# Altium schematic sheet ringled.SchDoc
size A4
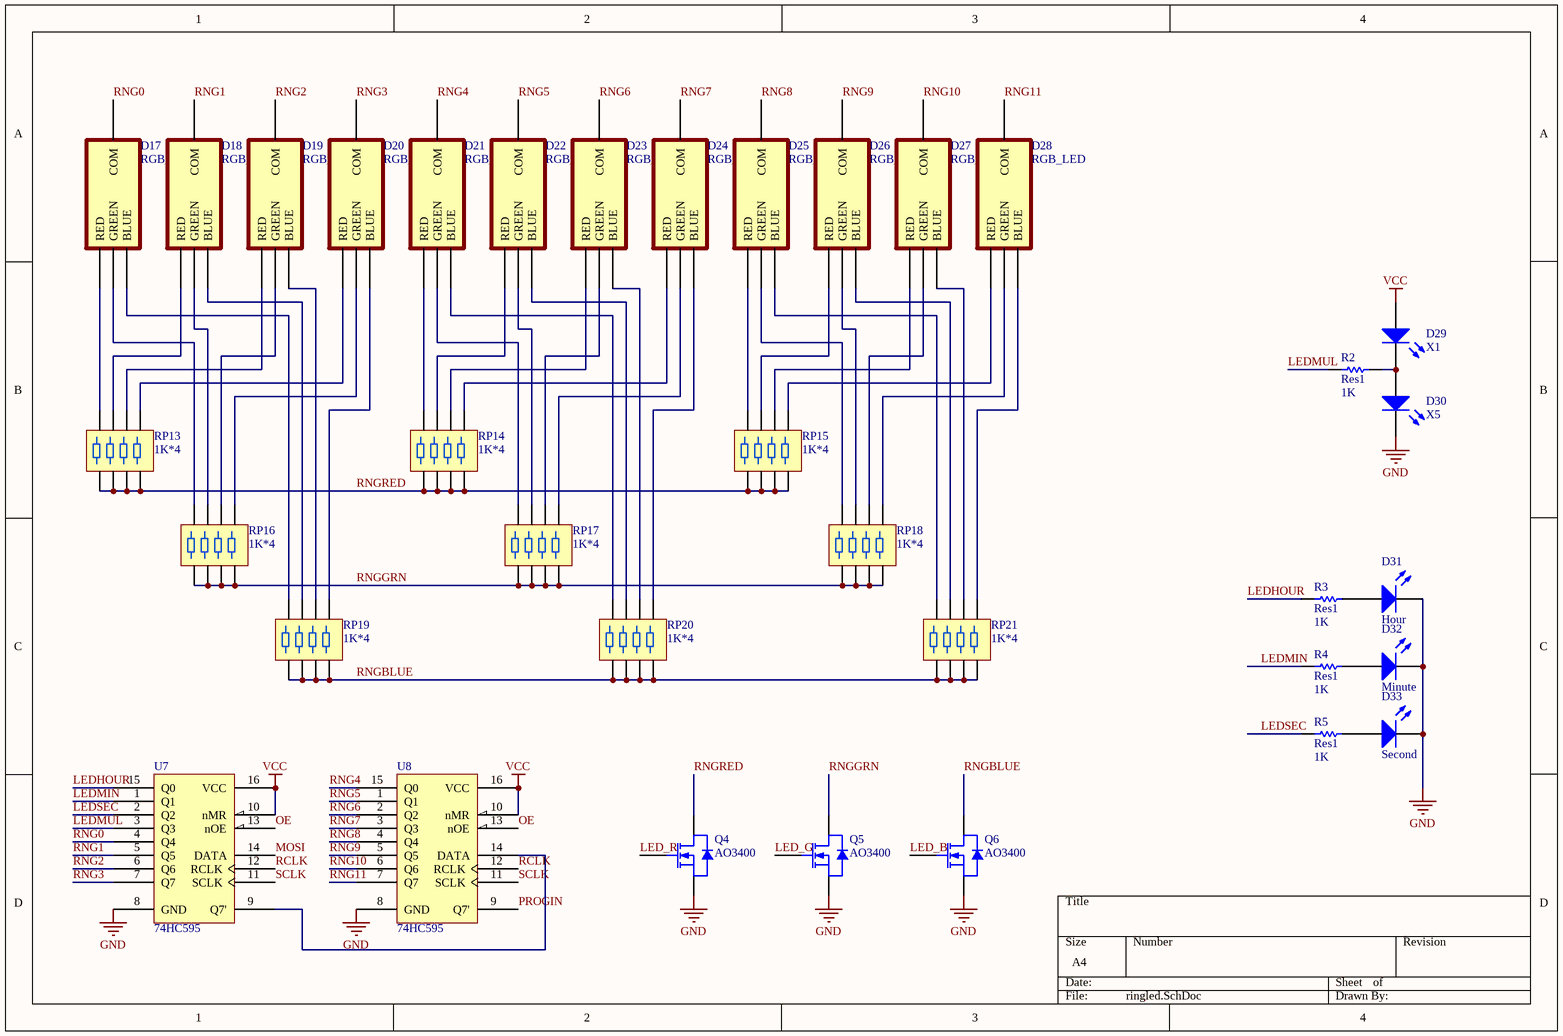
[diagram p0: ringled.SchDoc]

## Parts
D17  RGB_LED  [0805_RGB]
D18  RGB_LED  [0805_RGB]
D19  RGB_LED  [0805_RGB]
D20  RGB_LED  [0805_RGB]
D21  RGB_LED  [0805_RGB]
D22  RGB_LED  [0805_RGB]
D23  RGB_LED  [0805_RGB]
D24  RGB_LED  [0805_RGB]
D25  RGB_LED  [0805_RGB]
D26  RGB_LED  [0805_RGB]
D27  RGB_LED  [0805_RGB]
D28  RGB_LED  [0805_RGB]
D29  X1  [0805_LED]
D30  X5  [0805_LED]
D31  Hour  [0805_LED]
D32  Minute  [0805_LED]
D33  Second  [0805_LED]
Q4  AO3400  [SOT-23]
Q5  AO3400  [SOT-23]
Q6  AO3400  [SOT-23]
R2  Res1  value 1K  [0805]
R3  Res1  value 1K  [0805]
R4  Res1  value 1K  [0805]
R5  Res1  value 1K  [0805]
RP13  1K*4  [0603X4]
RP14  1K*4  [0603X4]
RP15  1K*4  [0603X4]
RP16  1K*4  [0603X4]
RP17  1K*4  [0603X4]
RP18  1K*4  [0603X4]
RP19  1K*4  [0603X4]
RP20  1K*4  [0603X4]
RP21  1K*4  [0603X4]
U7  74HC595  [TSSOP16]
U8  74HC595  [TSSOP16]

## Nets
GND: D30.2(K) D31.2(K) D32.2(K) D33.2(K) Q4.2(S) Q5.2(S) Q6.2(S) U7.8(GND) U8.8(GND)
VCC: D29.1(A) U7.10(nMR) U7.16(VCC) U8.10(nMR) U8.16(VCC)
LED_B: Q6.1(G)
LED_G: Q5.1(G)
LED_R: Q4.1(G)
LEDHOUR: R3.1 U7.15(Q0)
LEDMIN: R4.1 U7.1(Q1)
LEDMUL: R2.1 U7.3(Q3)
LEDSEC: R5.1 U7.2(Q2)
MOSI: U7.14(DATA)
OE: U7.13(nOE) U8.13(nOE)
PROGIN: U8.9(Q7')
RCLK: U7.12(RCLK) U8.12(RCLK)
RNG0: D17.COM U7.4(Q4)
RNG1: D18.COM U7.5(Q5)
RNG2: D19.COM U7.6(Q6)
RNG3: D20.COM U7.7(Q7)
RNG4: D21.COM U8.15(Q0)
RNG5: D22.COM U8.1(Q1)
RNG6: D23.COM U8.2(Q2)
RNG7: D24.COM U8.3(Q3)
RNG8: D25.COM U8.4(Q4)
RNG9: D26.COM U8.5(Q5)
RNG10: D27.COM U8.6(Q6)
RNG11: D28.COM U8.7(Q7)
RNGBLUE: Q6.3(D) RP19.1 RP19.2 RP19.3 RP19.4 RP20.1 RP20.2 RP20.3 RP20.4 RP21.1 RP21.2 RP21.3 RP21.4
RNGGRN: Q5.3(D) RP16.1 RP16.2 RP16.3 RP16.4 RP17.1 RP17.2 RP17.3 RP17.4 RP18.1 RP18.2 RP18.3 RP18.4
RNGRED: Q4.3(D) RP13.1 RP13.2 RP13.3 RP13.4 RP14.1 RP14.2 RP14.3 RP14.4 RP15.1 RP15.2 RP15.3 RP15.4
SCLK: U7.11(SCLK) U8.11(SCLK)
NetD17_B: D17.B(BLUE) RP19.8
NetD17_G: D17.G(GREEN) RP16.8
NetD17_R: D17.R(RED) RP13.8
NetD18_B: D18.B(BLUE) RP19.7
NetD18_G: D18.G(GREEN) RP16.7
NetD18_R: D18.R(RED) RP13.7
NetD19_B: D19.B(BLUE) RP19.6
NetD19_G: D19.G(GREEN) RP16.6
NetD19_R: D19.R(RED) RP13.6
NetD20_B: D20.B(BLUE) RP19.5
NetD20_G: D20.G(GREEN) RP16.5
NetD20_R: D20.R(RED) RP13.5
NetD21_B: D21.B(BLUE) RP20.8
NetD21_G: D21.G(GREEN) RP17.8
NetD21_R: D21.R(RED) RP14.8
NetD22_B: D22.B(BLUE) RP20.7
NetD22_G: D22.G(GREEN) RP17.7
NetD22_R: D22.R(RED) RP14.7
NetD23_B: D23.B(BLUE) RP20.6
NetD23_G: D23.G(GREEN) RP17.6
NetD23_R: D23.R(RED) RP14.6
NetD24_B: D24.B(BLUE) RP20.5
NetD24_G: D24.G(GREEN) RP17.5
NetD24_R: D24.R(RED) RP14.5
NetD25_B: D25.B(BLUE) RP21.8
NetD25_G: D25.G(GREEN) RP18.8
NetD25_R: D25.R(RED) RP15.8
NetD26_B: D26.B(BLUE) RP21.7
NetD26_G: D26.G(GREEN) RP18.7
NetD26_R: D26.R(RED) RP15.7
NetD27_B: D27.B(BLUE) RP21.6
NetD27_G: D27.G(GREEN) RP18.6
NetD27_R: D27.R(RED) RP15.6
NetD28_B: D28.B(BLUE) RP21.5
NetD28_G: D28.G(GREEN) RP18.5
NetD28_R: D28.R(RED) RP15.5
NetD29_2: D29.2(K) D30.1(A) R2.2
NetD31_1: D31.1(A) R3.2
NetD32_1: D32.1(A) R4.2
NetD33_1: D33.1(A) R5.2
NetU7_9: U7.9(Q7') U8.14(DATA)

## Library data of the parts
D17-D28 = RGBLED
D29-D33 = LED0: Typical INFRARED GaAs LED; Published: 8-Jun-2000; LatestRevisionDate: 08-Jul-2005; LatestRevisionNote: Mech Layer 1 removed.; PackageReference: LED-0; Publisher: Altium Limited; PackageDescription: LED; 2 Leads
Q4-Q6 = AO3400: N-Channel MOSFET; Published: 8-Jun-2000; Revision: July-2002: Re-released for DXP Platform.; Publisher: Altium Limited
R2-R5 = Res1: Resistor; Published: 8-Jun-2000; LatestRevisionDate: 17-Jul-2002; LatestRevisionNote: Re-released for DXP Platform.; PackageReference: AXIAL-0.3; Publisher: Altium Limited; PackageDescription: Axial Device, Thru-Hole; 2 Leads; 0.3 in Pin Spacing
RP13-RP21 = RPack_4
U7 U8 = 74HC595: 8-bit serial-in, serial or parallel-out shift register with output latches; 3-state